# Altium schematic sheet 37.SchDoc (part 1 of 2)
size 513 x 386 mm
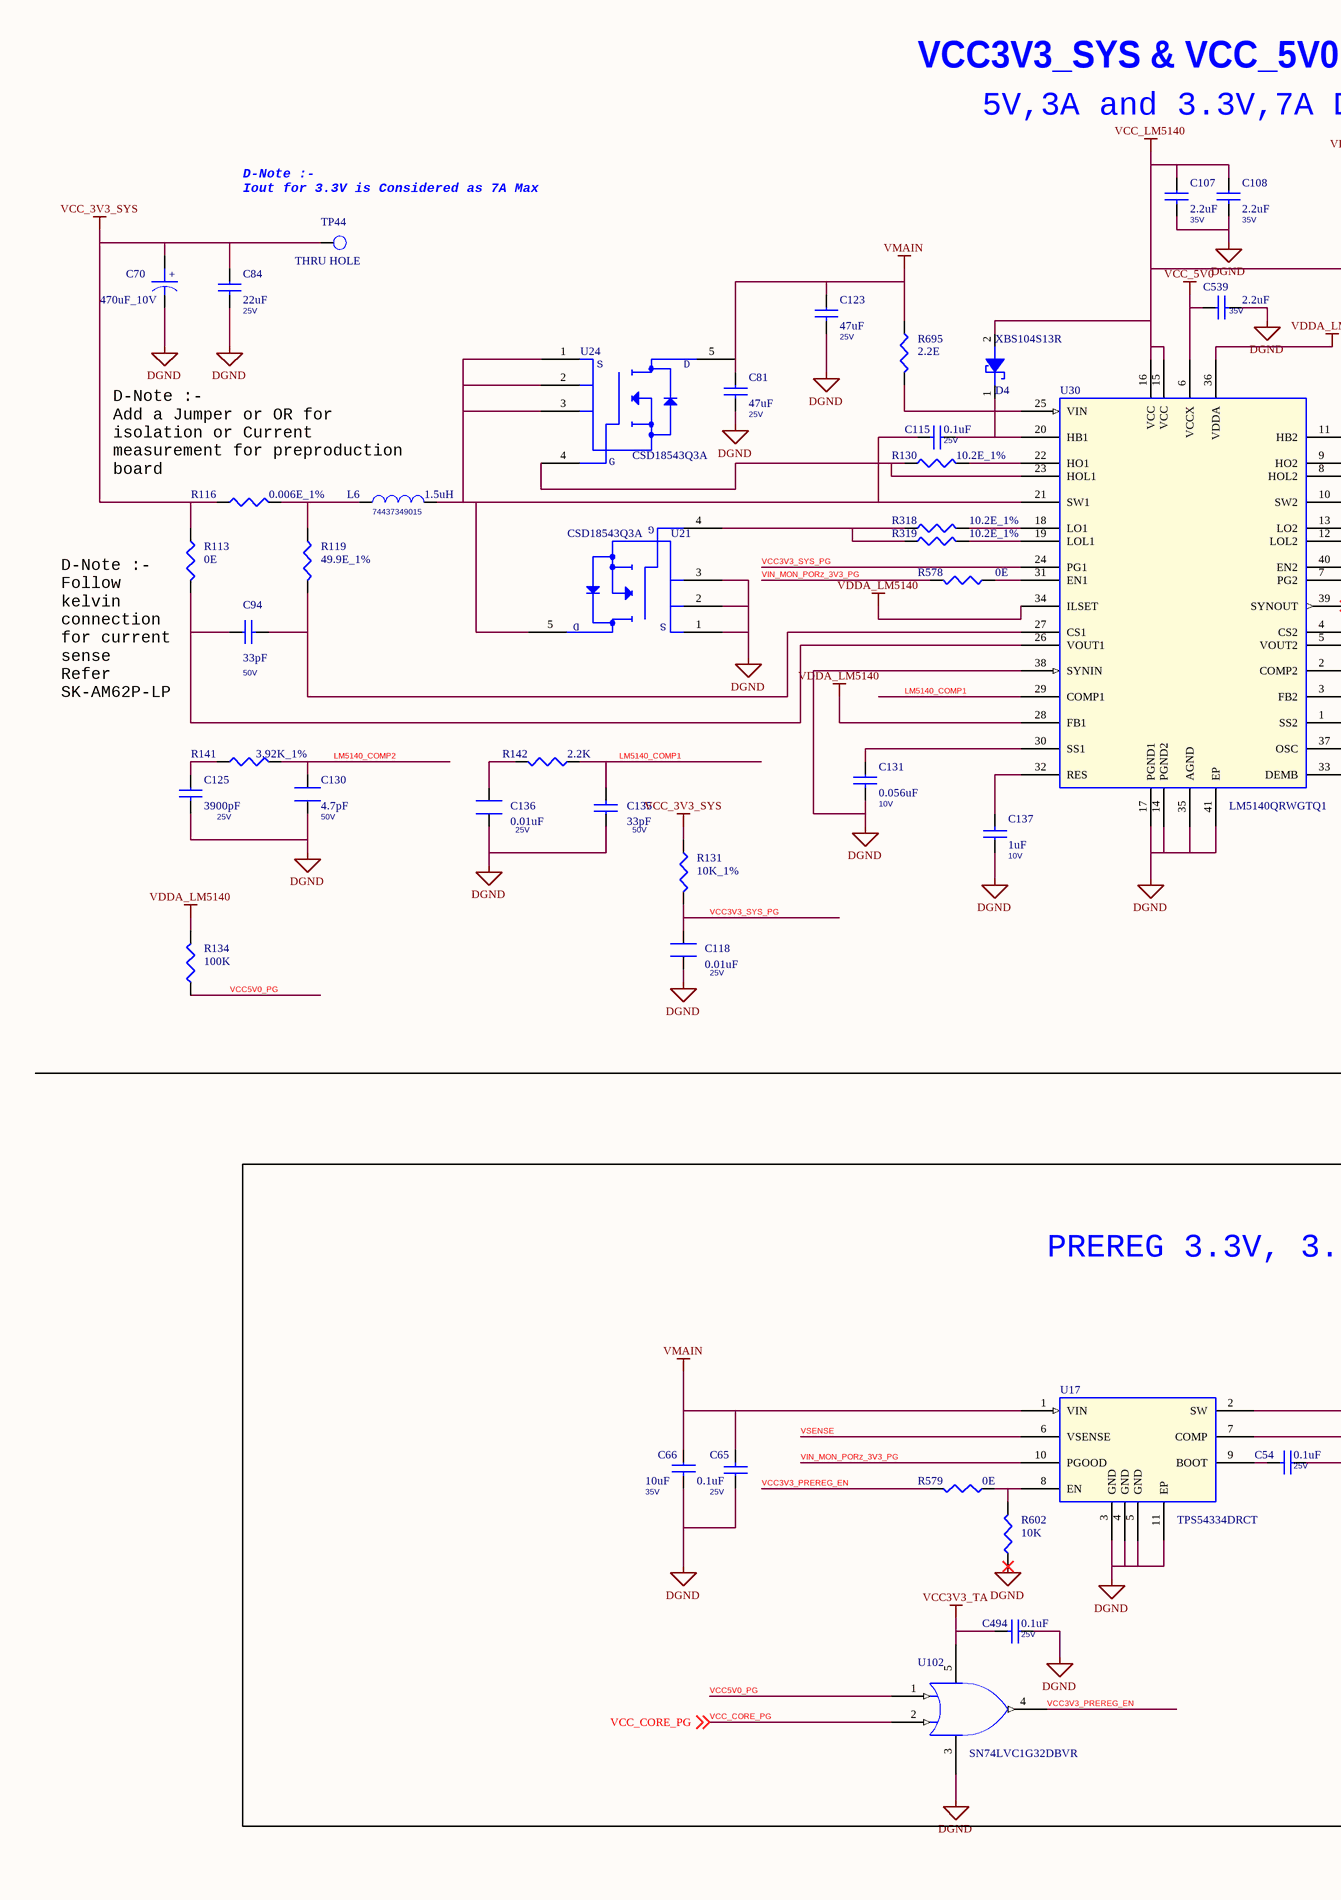
[diagram p0: 37.SchDoc, left]
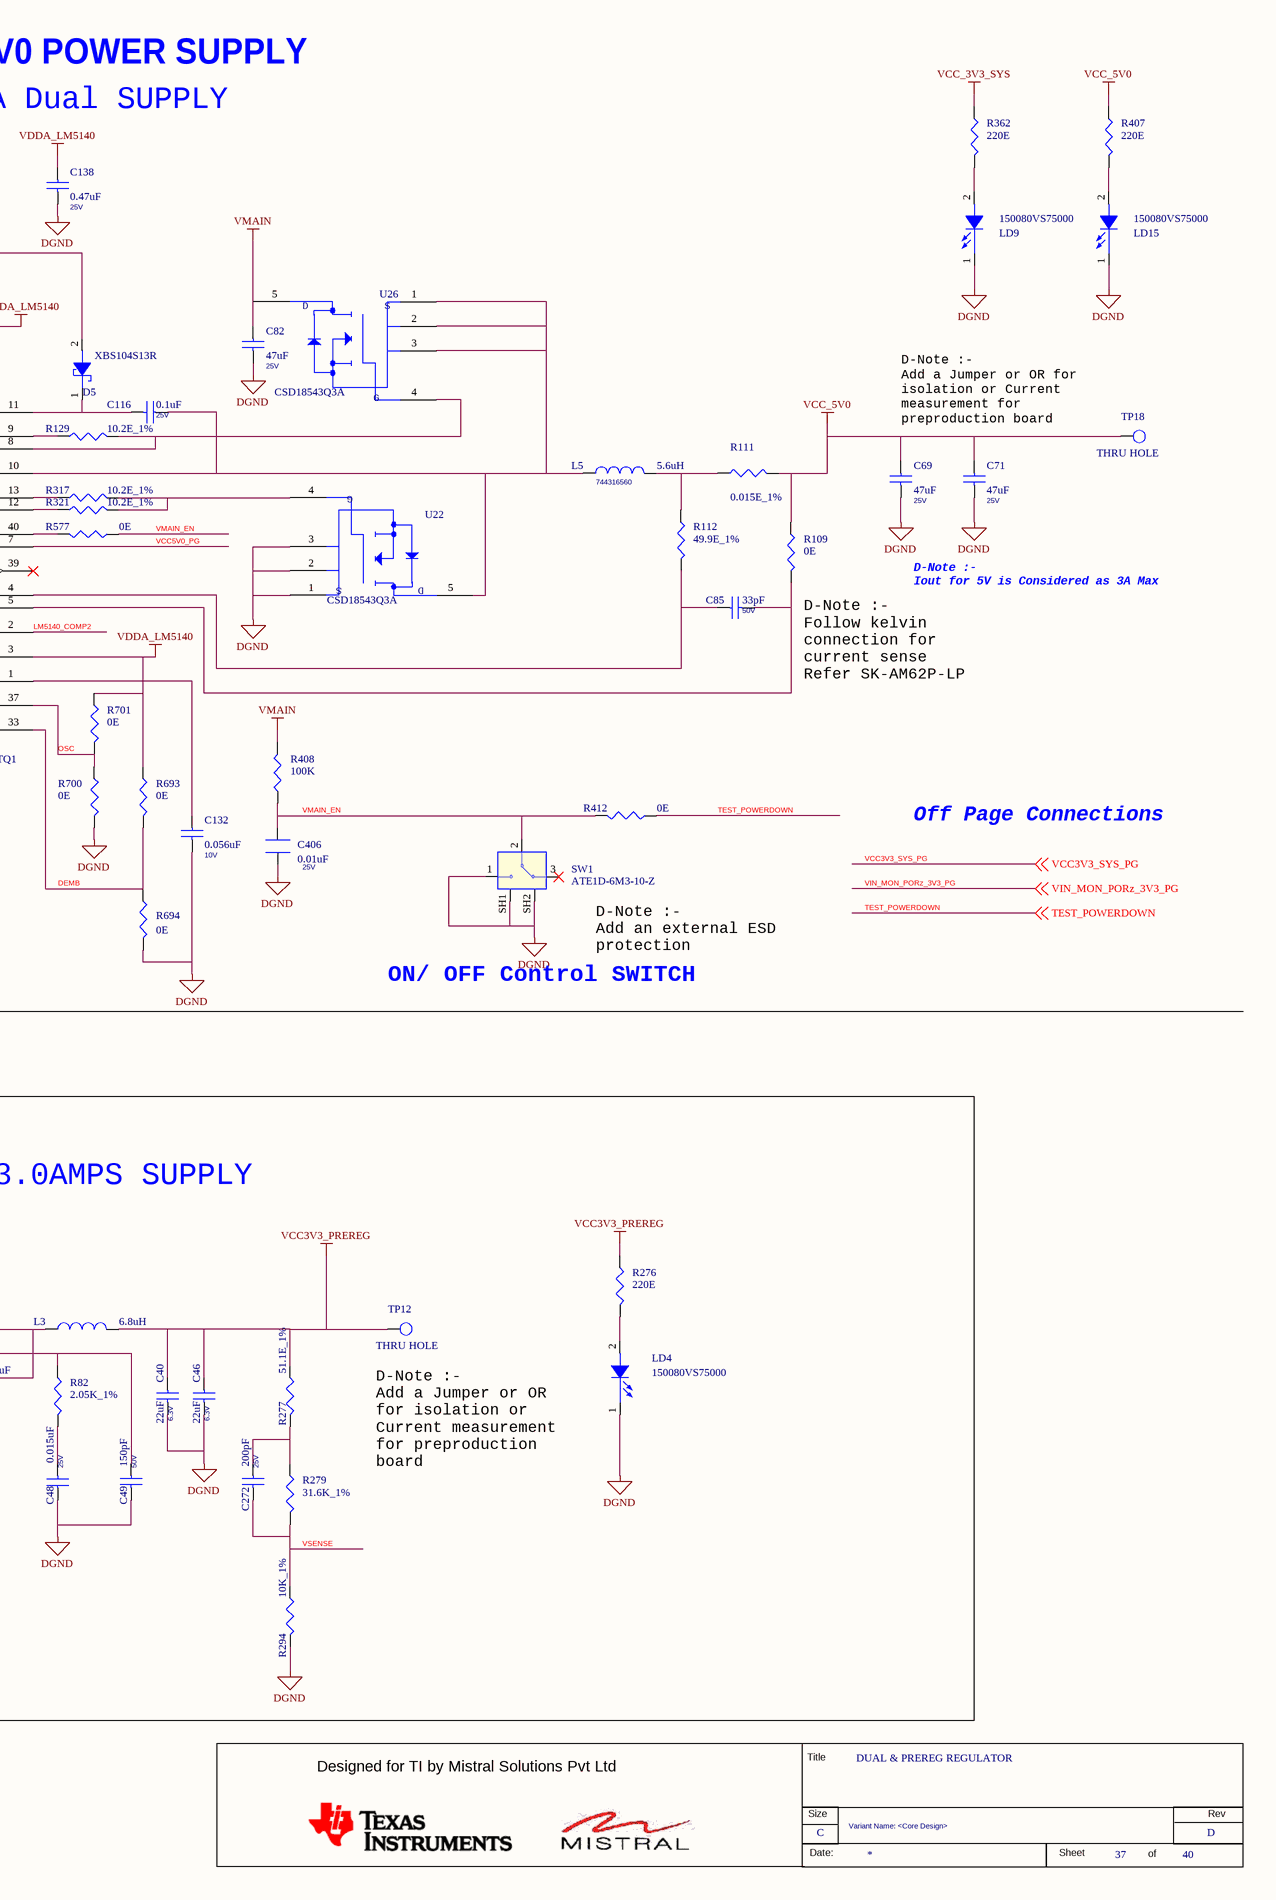
[diagram p1: 37.SchDoc, right]

## Parts
*  RevCode: D  Title: DUAL & PREREG REGULATOR  Page Size: C  Page Number: 37  Page Count: 40  Variant Name: <Core Design>  (hidden comment: MISTRAL_TITLEBLK_CSIZE)  (graphical)
C40  22uF  Voltage: 6.3V  [CAP0603_1]
C46  22uF  Voltage: 6.3V  [CAP0603_1]
C48  0.015uF  Voltage: 25V  [CAP0402_0-75]
C49  150pF  Voltage: 50V  [CAP0402_0-75]
C54  0.1uF  Voltage: 25V  [CAP0402_0-75]
C65  0.1uF  Voltage: 25V  [CAP0402_0-75]
C66  10uF  Voltage: 35V  [CAP0603_1]
C69  47uF  Voltage: 25V  [CAP1206_2]
C70  470uF_10V  [CAPAE_875115252003_330X330_SMD_8-7]
C71  47uF  Voltage: 25V  [CAP1206_2]
C81  47uF  Voltage: 25V  [CAP1206_2]
C82  47uF  Voltage: 25V  [CAP1206_2]
C84  22uF  Voltage: 25V  [CAP1206_2]
C85  33pF  Voltage: 50V  [CAP0402_0-75]
C94  33pF  Voltage: 50V  [CAP0402_0-75]
C107  2.2uF  Voltage: 35V  [CAP0603_1]
C108  2.2uF  Voltage: 35V  [CAP0603_1]
C115  0.1uF  Voltage: 25V  [CAP0402_0-75]
C116  0.1uF  Voltage: 25V  [CAP0402_0-75]
C118  0.01uF  Voltage: 25V  [CAP0402N]
C123  47uF  Voltage: 25V  [CAP1206_2]
C125  3900pF  Voltage: 25V  [CAP0402_0-75]
C130  4.7pF  Voltage: 50V  [CAP0402N]
C131  0.056uF  Voltage: 10V  [CAP0402_0-75]
C132  0.056uF  Voltage: 10V  [CAP0402_0-75]
C135  33pF  Voltage: 50V  [CAP0402_0-75]
C136  0.01uF  Voltage: 25V  [CAP0402N]
C137  1uF  Voltage: 10V  [CAP0402_0-75]
C138  0.47uF  Voltage: 25V  [CAP0603_1]
C272  200pF  Voltage: 25V  [CAP0402_0-75]
C406  0.01uF  Voltage: 25V  [CAP0402N]
C494  0.1uF  Voltage: 25V  [CAP0402_0-75]
C539  2.2uF  Voltage: 35V  [CAP0603_1]
D4  XBS104S13R  [DIO_SOD323_1]
D5  XBS104S13R  [DIO_SOD323_1]
L3  6.8uH  [IND_74439346068_260X270_SMD_6-1]
L5  5.6uH  Mfr_part_number: 744316560  [IND_744316100_230X220_SMD_4-3]
L6  1.5uH  Mfr_part_number: 74437349015  [IND_74437349012_270X270_SMD_5]
LD4  150080VS75000  [LED_150080VS75000_80X50_SMD_0-8]
LD9  150080VS75000  [LED_150080VS75000_80X50_SMD_0-8]
LD15  150080VS75000  [LED_150080VS75000_80X50_SMD_0-8]
R82  2.05K_1%  [RES0402_0-5]
R109  0E  [RES0402_0-5]
R111  0.015E_1%  [RES1206_1]
R112  49.9E_1%  [RES0402_0-5]
R113  0E  [RES0402_0-5]
R116  0.006E_1%  [RES1206_0-75]
R119  49.9E_1%  [RES0402_0-5]
R129  10.2E_1%  [RES0402_0-5]
R130  10.2E_1%  [RES0402_0-5]
R131  10K_1%  [RES0402_0-5]
R134  100K  [RES0402_0-5]
R141  3.92K_1%  [RES0402_0-5]
R142  2.2K  [RES0402_0-5]
R276  220E  [RES0402_0-5]
R277  51.1E_1%  [RES0402_0-5]
R279  31.6K_1%  [RES0402_0-5]
R294  10K_1%  [RES0402_0-5]
R317  10.2E_1%  [RES0402_0-5]
R318  10.2E_1%  [RES0402_0-5]
R319  10.2E_1%  [RES0402_0-5]
R321  10.2E_1%  [RES0402_0-5]
R362  220E  [RES0402_0-5]
R407  220E  [RES0402_0-5]
R408  100K  [RES0402_0-5]
R412  0E  [RES0402_0-5]
R577  0E  [RES0402_0-5]
R578  0E  [RES0402_0-5]
R579  0E  [RES0402_0-5]
R602  10K  [RES0402_0-5]
R693  0E  [RES0402_0-5]
R694  0E  [RES0402_0-5]
R695  2.2E  [RES0603_0-75]
R700  0E  [RES0402_0-5]
R701  0E  [RES0402_0-5]
SW1  ATE1D-6M3-10-Z  [SW3_ATE1F-6M3_370X710_TH_5-6]
TP12  THRU HOLE  [TP_40X65]
TP18  THRU HOLE  [TP_40X65]
TP44  THRU HOLE  [TP_40X65]
U17  TPS54334DRCT  [SON10_19-68_125X125_1]
U21  CSD18543Q3A  [VSONP8_CSD18543Q_120X130_0-9]
U22  CSD18543Q3A  [VSONP8_CSD18543Q_120X130_0-9]
U24  CSD18543Q3A  [VSONP8_CSD18543Q_120X130_0-9]
U26  CSD18543Q3A  [VSONP8_CSD18543Q_120X130_0-9]
U30  LM5140QRWGTQ1  [TBD]
U102  SN74LVC1G32DBVR  [SOT23-5_1-5]

## Blocks framed on the sheet
PREREG 3.3V, 3.0AMPS SUPPLY: C40 C46 C48 C49 C54 C65 C66 C272 C494 L3 LD4 R82 R276 R277 R279 R294 R579 R602 TP12 U17 U102

## Nets
DGND: C40.2 C46.2 C48.1 C49.2 C65.1 C66.2 C69.2 C70.2 C71.2 C81.2 C82.2 C84.2 C107.2 C108.2 C118.2 C123.2 C125.2 C130.2 C131.2 C132.2 C135.1 C136.2 C137.1 C138.2 C406.2 C494.1 C539.2 LD4.1(CATHODE) LD9.1(CATHODE) LD15.1(CATHODE) R294.2 R602.1 R694.2 R700.2 SW1.1 SW1.SH1 SW1.SH2 U17.3(GND) U17.4(GND) U17.5(GND) U17.11(EP) U21.1(S1) U21.2(S2) U21.3(S3) U22.1(S1) U22.2(S2) U22.3(S3) U30.14(PGND2) U30.17(PGND1) U30.35(AGND) U30.38(SYNIN) U30.41(EP) U102.3(GND)
VCC3V3_PREREG: C40.1 C46.1 L3.2 R276.1 R277.1 TP12.1(TP)
VCC3V3_TA: C494.2 U102.5(VCC)
VCC_3V3_SYS: C70.1 C84.1 R113.1 R116.1 R131.1 R362.1 TP44.1(TP)
VCC_5V0: C69.1 C71.1 C539.1 R109.1 R111.2 R407.1 TP18.1(TP) U30.6(VCCX)
VCC_LM5140: C107.1 C108.1 D4.2(ANODE) D5.2(ANODE) U30.15(VCC) U30.16(VCC)
VDDA_LM5140: C138.1 R134.2 R693.1 R701.1 U30.3(FB2) U30.28(FB1) U30.34(ILSET) U30.36(VDDA)
VMAIN: C65.2 C66.1 C81.1 C82.1 C123.1 R408.2 R695.1 U17.1(VIN) U24.5(D) U26.5(D)
DEMB: R693.2 R694.1 U30.33(DEMB)
LM5140_COMP1: C135.2 R142.1 U30.29(COMP1)
LM5140_COMP2: C130.1 R141.2 U30.2(COMP2)
OSC: R700.1 R701.2 U30.37(OSC)
TEST_POWERDOWN: R412.1 ; off-sheet TEST_POWERDOWN
VCC3V3_PREREG_EN: R579.2 U102.4(Y)
VCC3V3_SYS_PG: C118.1 R131.2 U30.24(PG1) ; off-sheet VCC3V3_SYS_PG
VCC5V0_PG: R134.1 U30.7(PG2) U102.1(A)
VCC_CORE_PG: U102.2(B) ; off-sheet VCC_CORE_PG
VIN_MON_PORz_3V3_PG: R578.2 U17.10(PGOOD) ; off-sheet VIN_MON_PORz_3V3_PG
VMAIN_EN: C406.1 R408.1 R412.2 R577.1 SW1.2
VSENSE: C272.2 R279.2 R294.1 U17.6(VSENSE)
NetC48_2: C48.2 R82.2
NetC49_1: C49.1 R82.1 U17.7(COMP)
NetC54_1: C54.1 L3.1 U17.2(SW)
NetC54_2: C54.2 U17.9(BOOT)
NetC85_1: C85.1 R112.2 U30.4(CS2)
NetC85_2: C85.2 R109.2 U30.5(VOUT2)
NetC94_1: C94.1 R113.2 U30.26(VOUT1)
NetC94_2: C94.2 R119.2 U30.27(CS1)
NetC115_1: C115.1 D4.1(CATHODE) U30.20(HB1)
NetC115_2: C115.2 L6.2 U21.5(D) U24.1(S1) U24.2(S2) U24.3(S3) U30.21(SW1)
NetC116_1: C116.1 L5.1 U22.5(D) U26.1(S1) U26.2(S2) U26.3(S3) U30.10(SW2)
NetC116_2: C116.2 D5.1(CATHODE) U30.11(HB2)
NetC125_1: C125.1 R141.1
NetC131_1: C131.1 U30.30(SS1)
NetC132_1: C132.1 U30.1(SS2)
NetC136_1: C136.1 R142.2
NetC137_2: C137.2 U30.32(RES)
NetC272_1: C272.1 R277.2 R279.1
NetL5_2: L5.2 R111.1 R112.1
NetL6_1: L6.1 R116.2 R119.1
NetLD4_2: LD4.2(ANODE) R276.2
NetLD9_2: LD9.2(ANODE) R362.2
NetLD15_2: LD15.2(ANODE) R407.2
NetR129_1: R129.1 U30.9(HO2)
NetR129_2: R129.2 U26.4(G) U30.8(HOL2)
NetR130_1: R130.1 U24.4(G) U30.23(HOL1)
NetR130_2: R130.2 U30.22(HO1)
NetR317_1: R317.1 U30.13(LO2)
NetR317_2: R317.2 R321.2 U22.4(G)
NetR318_1: R318.1 R319.1 U21.4(G)
NetR318_2: R318.2 U30.18(LO1)
NetR319_2: R319.2 U30.19(LOL1)
NetR321_1: R321.1 U30.12(LOL2)
NetR577_2: R577.2 U30.40(EN2)
NetR578_1: R578.1 U30.31(EN1)
NetR579_1: R579.1 R602.2 U17.8(EN)
NetR695_2: R695.2 U30.25(VIN)

Not connected (* = marked no-connect by the designer): SW1 3*; U30 39(SYNOUT)*

## Notes on the sheet
- VCC3V3_SYS & VCC_5V0 POWER SUPPLY
- 5V,3A and 3.3V,7A Dual SUPPLY
- (near TP44) D-Note :-
  Iout for 3.3V is Considered as 7A Max
- D-Note :-
  Add a Jumper or OR for
  isolation or Current
  measurement for preproduction
  board
- D-Note :-
  Add a Jumper or OR for
  isolation or Current
  measurement for
  preproduction board
- (near R113) D-Note :-
  Follow
  kelvin
  connection
  for current
  sense
  Refer
  SK-AM62P-LP
- D-Note :-
  Iout for 5V is Considered as 3A Max
- (near R109) D-Note :-
  Follow kelvin
  connection for
  current sense
  Refer SK-AM62P-LP
- Off Page Connections
- D-Note :-
  Add an external ESD
  protection
- ON/ OFF Control SWITCH
- D-Note :-
  Add a Jumper or OR
  for isolation or
  Current measurement
  for preproduction
  board
- (in symbol CAP_POL) +
- (in symbol MISTRAL_TITLEBLK_CSIZE) Title; Designed for TI by Mistral Solutions Pvt Ltd; Size; Rev; Date:; Sheet; of
- (in symbol MOSFET_CSD18501Q5A) S